# Altium schematic sheet 7000D-5ch.SchDoc
size A4
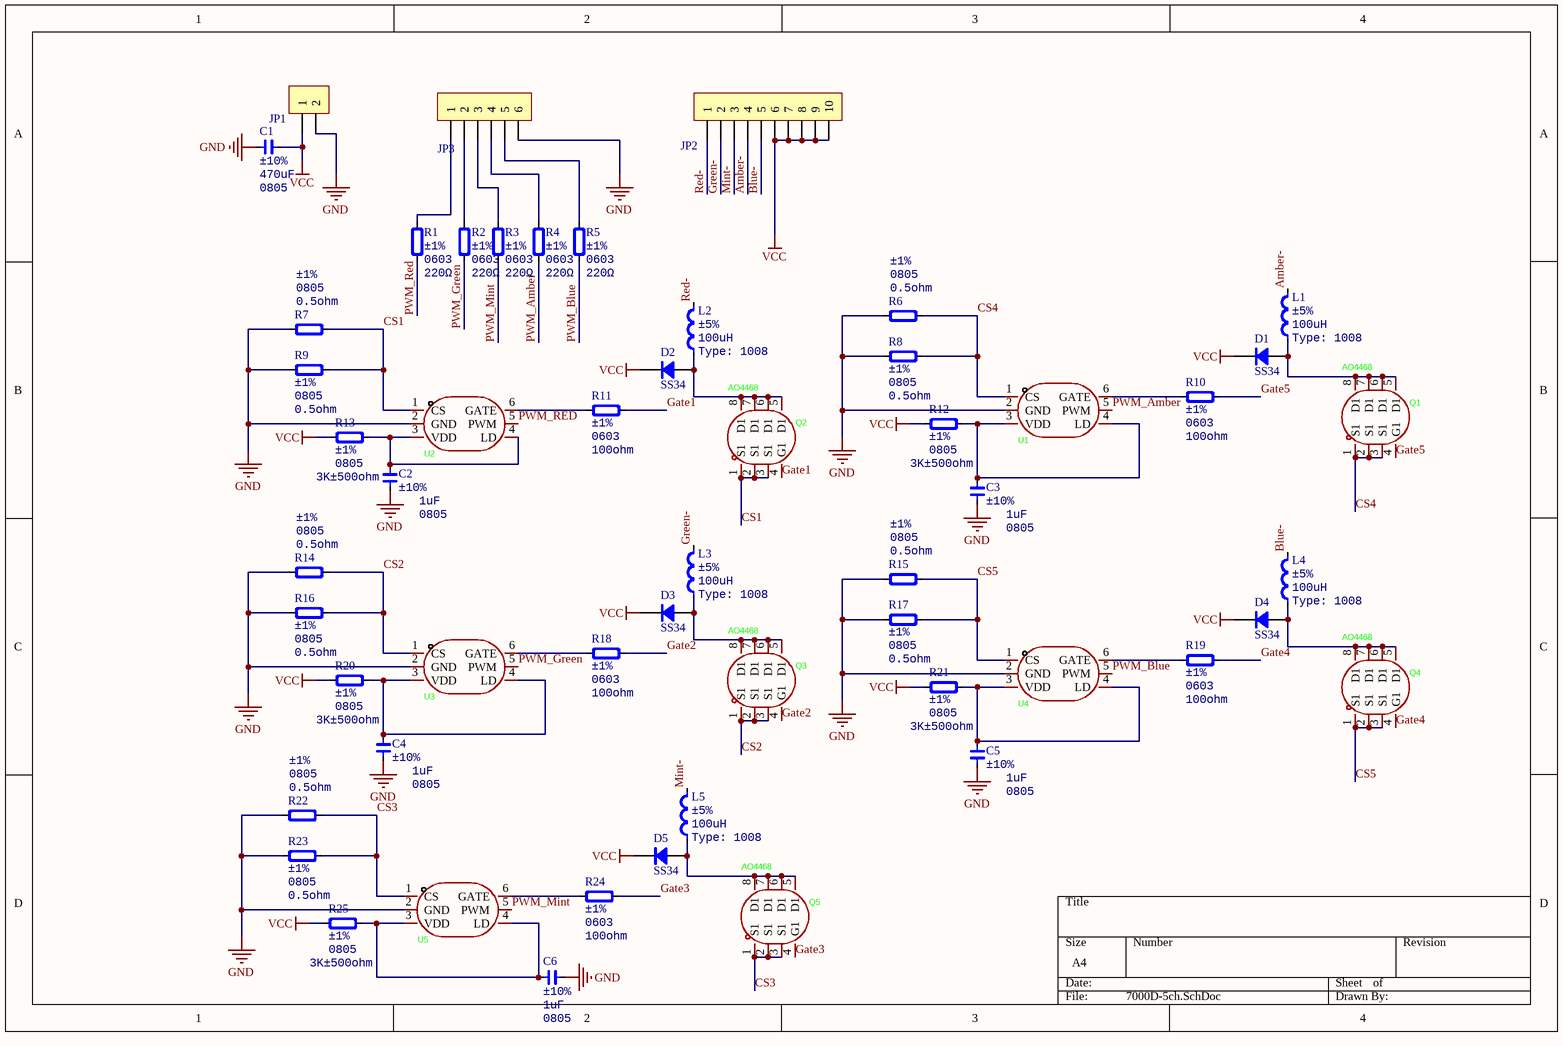
[diagram p0: 7000D-5ch.SchDoc]

## Parts
C1  value 470uF  Note: ±10%  Type: 0805  [CAP 5.0*10*16-H - GD]  (hidden comment: C0805)
C2  value 1uF  Note: ±10%  Type: 0805  [CAP_0805]  (hidden comment: C0805)
C3  value 1uF  Note: ±10%  Type: 0805  [CAP_0805]  (hidden comment: C0805)
C4  value 1uF  Note: ±10%  Type: 0805  [CAP_0805]  (hidden comment: C0805)
C5  value 1uF  Note: ±10%  Type: 0805  [CAP_0805]  (hidden comment: C0805)
C6  value 1uF  Note: ±10%  Type: 0805  [CAP_0805]  (hidden comment: C0805)
D1  SS34  [SMA]
D2  SS34  [SMA]
D3  SS34  [SMA]
D4  SS34  [SMA]
D5  SS34  [SMA]
JP1  HDR-1X2  [XH2.54-LI-2P]  (value not drawn)
JP2  HDR-1X10  [XH2.54-WI-10P]  (value not drawn)
JP3  HDR-1X6  [PH2.0-LI-6P]  (value not drawn)
L1  value 100uH  Note: ±5%  Type: 1008  [L_IND-SMD_L7.1-W6.6]  (hidden comment: H1008)
L2  value 100uH  Note: ±5%  Type: 1008  [L_IND-SMD_L7.1-W6.6]  (hidden comment: H1008)
L3  value 100uH  Note: ±5%  Type: 1008  [L_IND-SMD_L7.1-W6.6]  (hidden comment: H1008)
L4  value 100uH  Note: ±5%  Type: 1008  [L_IND-SMD_L7.1-W6.6]  (hidden comment: H1008)
L5  value 100uH  Note: ±5%  Type: 1008  [L_IND-SMD_L7.1-W6.6]  (hidden comment: H1008)
Q1  AO4468  [SOP_E150_8]
Q2  AO4468  [SOP_E150_8]
Q3  AO4468  [SOP_E150_8]
Q4  AO4468  [SOP_E150_8]
Q5  AO4468  [SOP_E150_8]
R1  value 220Ω  Note: ±1%  Type: 0603  [RES_0603]  (hidden comment: R0603)
R2  value 220Ω  Note: ±1%  Type: 0603  [RES_0603]  (hidden comment: R0603)
R3  value 220Ω  Note: ±1%  Type: 0603  [RES_0603]  (hidden comment: R0603)
R4  value 220Ω  Note: ±1%  Type: 0603  [RES_0603]  (hidden comment: R0603)
R5  value 220Ω  Note: ±1%  Type: 0603  [RES_0603]  (hidden comment: R0603)
R6  value 0.5ohm  Note: ±1%  Type: 0805  [RES_0805]  (hidden comment: R0805)
R7  value 0.5ohm  Note: ±1%  Type: 0805  [RES_0805]  (hidden comment: R0805)
R8  value 0.5ohm  Note: ±1%  Type: 0805  [RES_0805]  (hidden comment: R0805)
R9  value 0.5ohm  Note: ±1%  Type: 0805  [RES_0805]  (hidden comment: R0805)
R10  value 100ohm  Note: ±1%  Type: 0603  [RES_0603]  (hidden comment: R0603)
R11  value 100ohm  Note: ±1%  Type: 0603  [RES_0603]  (hidden comment: R0603)
R12  value 3K±500ohm  Note: ±1%  Type: 0805  [RES_0805]  (hidden comment: R0805)
R13  value 3K±500ohm  Note: ±1%  Type: 0805  [RES_0805]  (hidden comment: R0805)
R14  value 0.5ohm  Note: ±1%  Type: 0805  [RES_0805]  (hidden comment: R0805)
R15  value 0.5ohm  Note: ±1%  Type: 0805  [RES_0805]  (hidden comment: R0805)
R16  value 0.5ohm  Note: ±1%  Type: 0805  [RES_0805]  (hidden comment: R0805)
R17  value 0.5ohm  Note: ±1%  Type: 0805  [RES_0805]  (hidden comment: R0805)
R18  value 100ohm  Note: ±1%  Type: 0603  [RES_0603]  (hidden comment: R0603)
R19  value 100ohm  Note: ±1%  Type: 0603  [RES_0603]  (hidden comment: R0603)
R20  value 3K±500ohm  Note: ±1%  Type: 0805  [RES_0805]  (hidden comment: R0805)
R21  value 3K±500ohm  Note: ±1%  Type: 0805  [RES_0805]  (hidden comment: R0805)
R22  value 0.5ohm  Note: ±1%  Type: 0805  [RES_0805]  (hidden comment: R0805)
R23  value 0.5ohm  Note: ±1%  Type: 0805  [RES_0805]  (hidden comment: R0805)
R24  value 100ohm  Note: ±1%  Type: 0603  [RES_0603]  (hidden comment: R0603)
R25  value 3K±500ohm  Note: ±1%  Type: 0805  [RES_0805]  (hidden comment: R0805)
U1  Hi7000D  [SOT23-6]  (value not drawn)
U2  Hi7000D  [SOT23-6]  (value not drawn)
U3  Hi7000D  [SOT23-6]  (value not drawn)
U4  Hi7000D  [SOT23-6]  (value not drawn)
U5  Hi7000D  [SOT23-6]  (value not drawn)

## Nets
GND: C1.1 C2.1 C3.1 C4.1 C5.1 C6.1 JP1.2 JP3.6 R6.1 R7.1 R8.1 R9.1 R14.1 R15.1 R16.1 R17.1 R22.1 R23.1 U1.2(GND) U2.2(GND) U3.2(GND) U4.2(GND) U5.2(GND)
VCC: C1.2 D1.2(K) D2.2(K) D3.2(K) D4.2(K) D5.2(K) JP1.1 JP2.6 JP2.7 JP2.8 JP2.9 JP2.10 R12.1 R13.1 R20.1 R21.1 R25.1
Amber-: JP2.4 L1.2
Blue-: JP2.5 L4.2
CS1: Q2.1(S1) Q2.2(S1) Q2.3(S1) R7.2 R9.2 U2.1(CS)
CS2: Q3.1(S1) Q3.2(S1) Q3.3(S1) R14.2 R16.2 U3.1(CS)
CS3: Q5.1(S1) Q5.2(S1) Q5.3(S1) R22.2 R23.2 U5.1(CS)
CS4: Q1.1(S1) Q1.2(S1) Q1.3(S1) R6.2 R8.2 U1.1(CS)
CS5: Q4.1(S1) Q4.2(S1) Q4.3(S1) R15.2 R17.2 U4.1(CS)
Gate1: Q2.4(G1) R11.2
Gate2: Q3.4(G1) R18.2
Gate3: Q5.4(G1) R24.2
Gate4: Q4.4(G1) R19.2
Gate5: Q1.4(G1) R10.2
Green-: JP2.2 L3.2
Mint-: JP2.3 L5.2
PWM_Amber: R4.1 U1.5(PWM)
PWM_Blue: R5.1 U4.5(PWM)
PWM_Green: R2.1 U3.5(PWM)
PWM_Mint: R3.1 U5.5(PWM)
PWM_RED: R1.1 U2.5(PWM)
Red-: JP2.1 L2.2
NetC2_2: C2.2 R13.2 U2.3(VDD) U2.4(LD)
NetC3_2: C3.2 R12.2 U1.3(VDD) U1.4(LD)
NetC4_2: C4.2 R20.2 U3.3(VDD) U3.4(LD)
NetC5_2: C5.2 R21.2 U4.3(VDD) U4.4(LD)
NetC6_2: C6.2 R25.2 U5.3(VDD) U5.4(LD)
NetD1_1: D1.1(A) L1.1 Q1.5(D1) Q1.6(D1) Q1.7(D1) Q1.8(D1)
NetD2_1: D2.1(A) L2.1 Q2.5(D1) Q2.6(D1) Q2.7(D1) Q2.8(D1)
NetD3_1: D3.1(A) L3.1 Q3.5(D1) Q3.6(D1) Q3.7(D1) Q3.8(D1)
NetD4_1: D4.1(A) L4.1 Q4.5(D1) Q4.6(D1) Q4.7(D1) Q4.8(D1)
NetD5_1: D5.1(A) L5.1 Q5.5(D1) Q5.6(D1) Q5.7(D1) Q5.8(D1)
NetJP3_1: JP3.1 R1.2
NetJP3_2: JP3.2 R2.2
NetJP3_3: JP3.3 R3.2
NetJP3_4: JP3.4 R4.2
NetJP3_5: JP3.5 R5.2
NetR10_1: R10.1 U1.6(GATE)
NetR11_1: R11.1 U2.6(GATE)
NetR18_1: R18.1 U3.6(GATE)
NetR19_1: R19.1 U4.6(GATE)
NetR24_1: R24.1 U5.6(GATE)

## Library data of the parts
C1-C6 = Cap_0805: Capacitor; Specification: X7R, ±10%, 16V; Manufacturer: *
D1-D5 = SS34: 肖特基二极管; 版权归属: 源创客; 属性: 40V/3A; BOM名称: 肖特基二极管; 学习资源: www.ooocke.com
JP1 = Header 2: 2P接插件; 版权归属: 源创客; BOM名称: 2P接插件; 学习资源: www.ooocke.com
JP2 = Header 10: 10P接插件; 版权归属: 源创客; BOM名称: 10P接插件; 学习资源: www.ooocke.com
JP3 = Header 6: 6P接插件; 版权归属: 源创客; BOM名称: 6P接插件; 学习资源: www.ooocke.com
L1-L5 = Ind_1008: Inductor; Specification: High frequency chip inductor ±5%; Manufacturer: *
Q1-Q5 = AO4468_C5183837: Manufacturer: JSMSEMI(杰盛微); Add into BOM: yes; Type: 1个N沟道; Drain Source Voltage (Vdss): 30V; Continuous Drain Current (Id): 10A; Drain Source On Resistance (RDS(on)@Vgs,Id): 20mΩ@4.5V,8A; Power Dissipation (Pd): 1.8W; Gate Threshold Voltage (Vgs(th)@Id): 1V@250uA; Total Gate Charge (Qg@Vgs): 11.6nC@15V; Input Capacitance (Ciss@Vds): 770pF@25V; Reverse Transfer Capacitance (Crss@Vds): 90pF; Symbol: AO4468_C5183837; Device: AO4468_C5183837; LCSC Part Name: 1个N沟道 耐压:30V 电流:10A; Supplier Part: C5183837; Manufacturer Part: AO4468; Supplier Footprint: SOP-8; JLCPCB Part Class: Extended Part; Datasheet: https://atta.szlcsc.com/upload/public/pdf/source/20240105/02C4B597700191549CF21A6FC2767502.pdf; Supplier: LCSC; Convert to PCB: yes; Operating Temperature: -55℃~+150℃
R1-R5 R10 R11 R18 R19 R24 = Res_0603: Resistor; Manufacturer: *; Specification: ±1%
R6-R9 R12-R17 R20-R23 R25 = Res_0805: Resistor; Manufacturer: *; Specification: ±1%
U1-U5 = Hi7000D: Manufacturer: Hichips(智芯); Add into BOM: yes; Frequency - Switching: 1MHz; Number of Channels: 1; Output Current: 5A; Dimming: PWM；模拟; Symbol: HI7000D; Device: Hi7000D; LCSC Part Name: 多功能平均电流型LED恒流驱动器; Supplier Part: C2830172; Manufacturer Part: Hi7000D; Supplier Footprint: SOT-23-6; JLCPCB Part Class: Extended Part; Datasheet: https://item.szlcsc.com/datasheet/Hi7000D/2981192.html; Supplier: LCSC; Convert to PCB: yes; Voltage - Input(DC): -; Output Voltage: -; Topology: -; Operating temperature: -40℃~+125℃